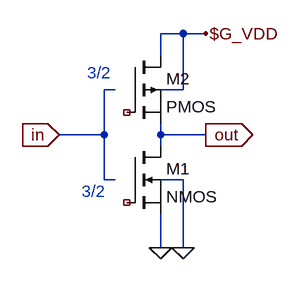
[diagram p0: schematic inv_min.asc]
inv_min.asc, the LTspice schematic file:
Version 4
SHEET 1 1292 836
WIRE -592 -80 -624 -80
WIRE -560 -80 -592 -80
WIRE -624 -48 -624 -80
WIRE -688 0 -704 0
WIRE -592 0 -592 -80
WIRE -592 0 -624 0
WIRE -704 64 -704 0
WIRE -704 64 -768 64
WIRE -624 64 -624 48
WIRE -560 64 -624 64
WIRE -624 80 -624 64
WIRE -704 128 -704 64
WIRE -688 128 -704 128
WIRE -592 128 -624 128
WIRE -624 224 -624 176
WIRE -592 224 -592 128
FLAG -624 224 0
FLAG -768 64 in
IOPIN -768 64 In
FLAG -560 64 out
IOPIN -560 64 Out
FLAG -560 -80 $G_VDD
FLAG -592 224 0
SYMBOL nmos -672 80 R0
SYMATTR InstName M1
SYMATTR Value2 l=0.6u w=0.9u
SYMBOL pmos -672 -48 R0
SYMATTR InstName M2
SYMATTR Value2 l=0.6u w=0.9u
TEXT -728 -24 Left 0 ;3/2
TEXT -736 144 Left 0 ;3/2

The netlist it stands for:
* inv_min.asc
* M1: NMOS l=0.6u w=0.9u (symbol nmos not certain, pin order unknown); nets seen at it: 0, out
* M2: PMOS l=0.6u w=0.9u (symbol pmos not certain, pin order unknown); nets seen at it: $G_VDD, out
* 3/2
* 3/2
.backanno
.end